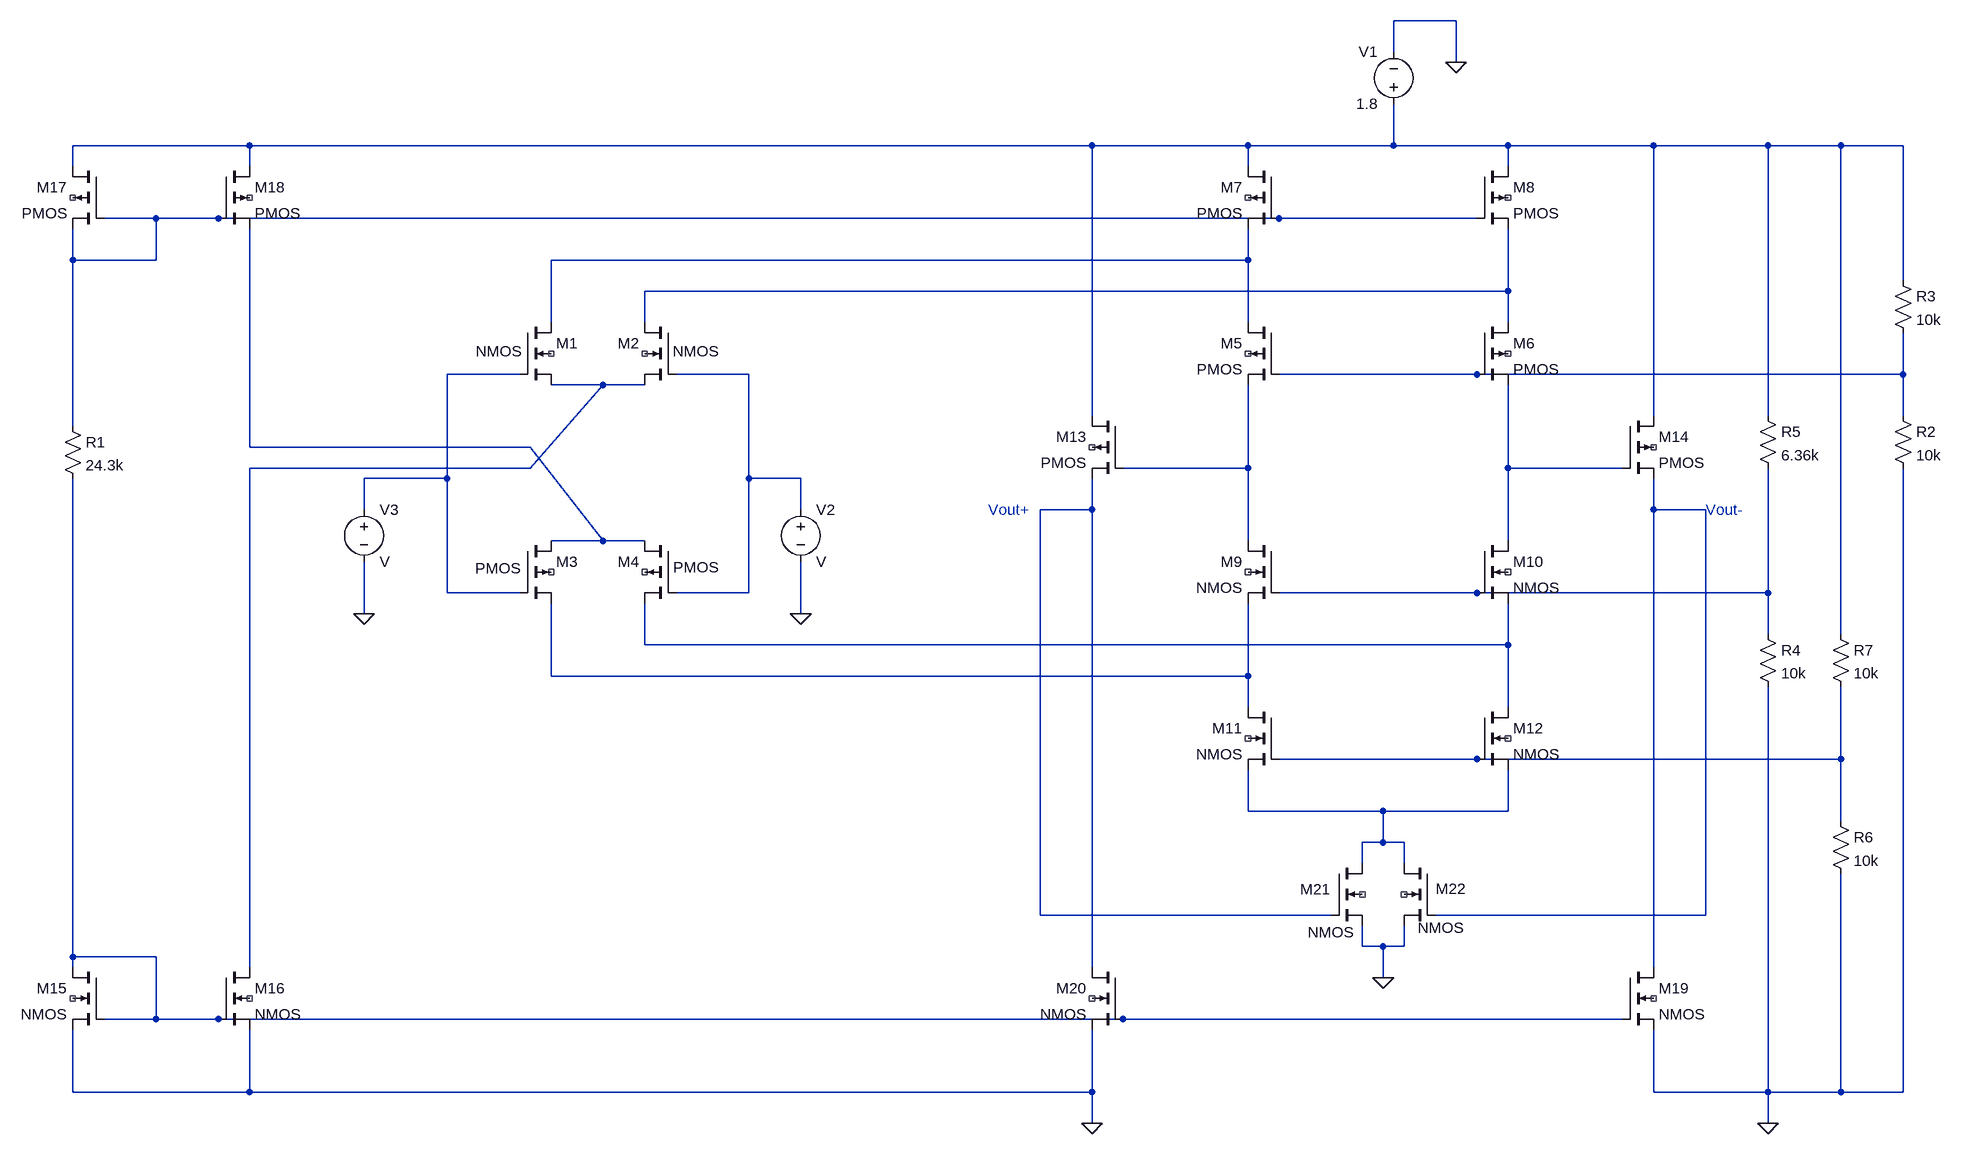
[diagram p0: schematic Project.asc]
Project.asc, the LTspice schematic file:
Version 4
SHEET 1 1912 1540
WIRE 1072 -528 976 -528
WIRE 976 -480 976 -528
WIRE 1072 -464 1072 -528
WIRE -784 -336 -1056 -336
WIRE 512 -336 -784 -336
WIRE 752 -336 512 -336
WIRE 976 -336 976 -400
WIRE 976 -336 752 -336
WIRE 1152 -336 976 -336
WIRE 1376 -336 1152 -336
WIRE 1552 -336 1376 -336
WIRE 1664 -336 1552 -336
WIRE 1760 -336 1664 -336
WIRE -1056 -304 -1056 -336
WIRE -784 -304 -784 -336
WIRE 752 -304 752 -336
WIRE 1152 -304 1152 -336
WIRE -928 -224 -1008 -224
WIRE -832 -224 -928 -224
WIRE 800 -224 -832 -224
WIRE 1104 -224 800 -224
WIRE -1056 -160 -1056 -208
WIRE -928 -160 -928 -224
WIRE -928 -160 -1056 -160
WIRE 752 -160 752 -208
WIRE 752 -160 -320 -160
WIRE 1760 -128 1760 -336
WIRE 1152 -112 1152 -208
WIRE 1152 -112 -176 -112
WIRE -320 -64 -320 -160
WIRE -176 -64 -176 -112
WIRE 752 -64 752 -160
WIRE 1152 -64 1152 -112
WIRE -368 16 -480 16
WIRE -16 16 -128 16
WIRE 1104 16 800 16
WIRE 1760 16 1760 -48
WIRE 1760 16 1104 16
WIRE -240 32 -320 32
WIRE -176 32 -240 32
WIRE 512 80 512 -336
WIRE 1376 80 1376 -336
WIRE 1552 80 1552 -336
WIRE 1760 80 1760 16
WIRE -1056 96 -1056 -160
WIRE -784 128 -784 -208
WIRE -352 128 -784 128
WIRE -352 160 -240 32
WIRE -352 160 -784 160
WIRE 752 160 752 32
WIRE 752 160 560 160
WIRE 1152 160 1152 32
WIRE 1328 160 1152 160
WIRE -480 176 -480 16
WIRE -480 176 -608 176
WIRE -16 176 -16 16
WIRE 64 176 -16 176
WIRE -608 224 -608 176
WIRE 64 224 64 176
WIRE 512 224 512 176
WIRE 512 224 432 224
WIRE 1376 224 1376 176
WIRE 1456 224 1376 224
WIRE -240 272 -352 128
WIRE -240 272 -320 272
WIRE -176 272 -240 272
WIRE 752 272 752 160
WIRE 1152 272 1152 160
WIRE -480 352 -480 176
WIRE -368 352 -480 352
WIRE -16 352 -16 176
WIRE -16 352 -128 352
WIRE 1104 352 800 352
WIRE 1552 352 1552 160
WIRE 1552 352 1104 352
WIRE -608 384 -608 304
WIRE 64 384 64 304
WIRE 1552 416 1552 352
WIRE 1664 416 1664 -336
WIRE -176 432 -176 368
WIRE 1152 432 1152 368
WIRE 1152 432 -176 432
WIRE -320 480 -320 368
WIRE 752 480 752 368
WIRE 752 480 -320 480
WIRE 752 528 752 480
WIRE 1152 528 1152 432
WIRE 1104 608 800 608
WIRE 1664 608 1664 496
WIRE 1664 608 1104 608
WIRE 752 688 752 624
WIRE 960 688 752 688
WIRE 1152 688 1152 624
WIRE 1152 688 960 688
WIRE 1664 704 1664 608
WIRE 960 736 960 688
WIRE 960 736 928 736
WIRE 992 736 960 736
WIRE 928 768 928 736
WIRE 992 768 992 736
WIRE 432 848 432 224
WIRE 880 848 432 848
WIRE 1456 848 1456 224
WIRE 1456 848 1040 848
WIRE 928 896 928 864
WIRE 960 896 928 896
WIRE 992 896 992 864
WIRE 992 896 960 896
WIRE -1056 912 -1056 176
WIRE -928 912 -1056 912
WIRE -1056 928 -1056 912
WIRE -784 928 -784 160
WIRE 512 928 512 224
WIRE 1376 928 1376 224
WIRE 960 944 960 896
WIRE -928 1008 -928 912
WIRE -928 1008 -1008 1008
WIRE -832 1008 -928 1008
WIRE 560 1008 -832 1008
WIRE 1328 1008 560 1008
WIRE -1056 1120 -1056 1024
WIRE -784 1120 -784 1024
WIRE -784 1120 -1056 1120
WIRE 512 1120 512 1024
WIRE 512 1120 -784 1120
WIRE 1376 1120 1376 1024
WIRE 1552 1120 1552 496
WIRE 1552 1120 1376 1120
WIRE 1664 1120 1664 784
WIRE 1664 1120 1552 1120
WIRE 1760 1120 1760 160
WIRE 1760 1120 1664 1120
WIRE 512 1168 512 1120
WIRE 1552 1168 1552 1120
FLAG 1072 -464 0
FLAG 512 1168 0
FLAG -608 384 0
FLAG 64 384 0
FLAG 1552 1168 0
FLAG 960 944 0
SYMBOL nmos4 -368 -64 R0
WINDOW 3 -68 44 Left 2
SYMATTR InstName M1
SYMBOL nmos4 -128 -64 M0
WINDOW 3 -67 44 Left 2
SYMATTR InstName M2
SYMBOL pmos4 -368 272 R0
WINDOW 3 -69 42 Left 2
SYMATTR InstName M3
SYMBOL pmos4 -128 272 M0
WINDOW 3 -66 41 Left 2
SYMATTR InstName M4
SYMBOL pmos4 800 -64 M0
SYMATTR InstName M5
SYMBOL pmos4 1104 -64 R0
SYMATTR InstName M6
SYMBOL pmos4 800 -304 M0
SYMATTR InstName M7
SYMBOL pmos4 1104 -304 R0
SYMATTR InstName M8
SYMBOL nmos4 800 272 M0
SYMATTR InstName M9
SYMBOL nmos4 1104 272 R0
SYMATTR InstName M10
SYMBOL nmos4 800 528 M0
SYMATTR InstName M11
SYMBOL nmos4 1104 528 R0
SYMATTR InstName M12
SYMBOL voltage 976 -384 R180
WINDOW 0 24 96 Left 2
WINDOW 3 24 16 Left 2
WINDOW 123 0 0 Left 0
WINDOW 39 0 0 Left 0
SYMATTR InstName V1
SYMATTR Value 1.8
SYMBOL pmos4 560 80 M0
SYMATTR InstName M13
SYMBOL pmos4 1328 80 R0
SYMATTR InstName M14
SYMBOL voltage 64 208 R0
SYMATTR InstName V2
SYMBOL voltage -608 208 R0
SYMATTR InstName V3
SYMBOL nmos4 -1008 928 M0
SYMATTR InstName M15
SYMBOL nmos4 -832 928 R0
SYMATTR InstName M16
SYMBOL pmos4 -1008 -304 M0
SYMATTR InstName M17
SYMBOL pmos4 -832 -304 R0
SYMATTR InstName M18
SYMBOL res -1072 80 R0
SYMATTR InstName R1
SYMATTR Value 24.3k
SYMBOL nmos4 1328 928 R0
SYMATTR InstName M19
SYMBOL nmos4 560 928 M0
SYMATTR InstName M20
SYMBOL res 1744 64 R0
SYMATTR InstName R2
SYMATTR Value 10k
SYMBOL res 1744 -144 R0
SYMATTR InstName R3
SYMATTR Value 10k
SYMBOL res 1536 400 R0
SYMATTR InstName R4
SYMATTR Value 10k
SYMBOL res 1536 64 R0
SYMATTR InstName R5
SYMATTR Value 6.36k
SYMBOL nmos4 880 768 R0
WINDOW 0 -48 40 Left 2
WINDOW 3 -36 106 Left 2
SYMATTR InstName M21
SYMBOL nmos4 1040 768 M0
WINDOW 0 -48 39 Left 2
WINDOW 3 -45 99 Left 2
SYMATTR InstName M22
SYMBOL res 1648 688 R0
SYMATTR InstName R6
SYMATTR Value 10k
SYMBOL res 1648 400 R0
SYMATTR InstName R7
SYMATTR Value 10k
TEXT 352 224 Left 2 ;Vout+
TEXT 1456 224 Left 2 ;Vout-

The netlist it stands for:
* Project.asc
M1 N003 N005 N008 NC_01 NMOS
M2 N004 N006 N008 NC_02 NMOS
M3 N009 N005 N016 NC_03 PMOS
M4 N009 N006 N015 NC_04 PMOS
M5 N003 N007 N010 NC_05 PMOS
M6 N004 N007 N011 NC_06 PMOS
M7 N001 N002 N003 NC_07 PMOS
M8 N001 N002 N004 NC_08 PMOS
M9 N010 N014 N016 NC_09 NMOS
M10 N011 N014 N015 NC_10 NMOS
M11 N016 N017 N018 NC_11 NMOS
M12 N015 N017 N018 NC_12 NMOS
V1 N001 0 1.8
M13 N001 N010 N012 NC_13 PMOS
M14 N001 N011 N013 NC_14 PMOS
V2 N006 0 V
V3 N005 0 V
M15 N019 N019 0 NC_15 NMOS
M16 N008 N019 0 NC_16 NMOS
M17 N001 N002 N002 NC_17 PMOS
M18 N001 N002 N009 NC_18 PMOS
R1 N002 N019 24.3k
M19 N013 N019 0 NC_19 NMOS
M20 N012 N019 0 NC_20 NMOS
R2 N007 0 10k
R3 N001 N007 10k
R4 N014 0 10k
R5 N001 N014 6.36k
M21 N018 N012 0 NC_21 NMOS
M22 N018 N013 0 NC_22 NMOS
R6 N017 0 10k
R7 N001 N017 10k
.model NMOS NMOS
.model PMOS PMOS
.lib standard.mos
* Vout+
* Vout-
.backanno
.end